# Altium project shkb_pro3_lite.PrjPcb
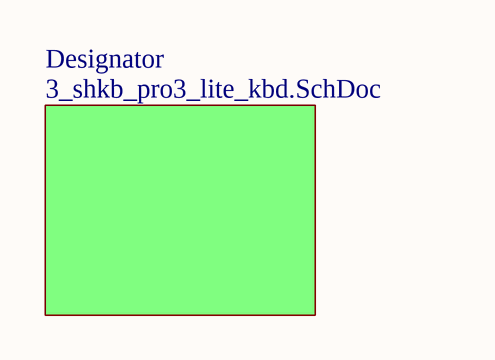
[diagram p0: 1_shkb_pro3_lite_top.SchDoc]
ProjectTitle: SHKB Pro3 Lite; Revision: A1
2 sheets, 37 parts. Net scope: flat (ports and power ports of the same name join across sheets).
Board file: shkb_pro3_lite.PcbDoc
Sheets:
  1_shkb_pro3_lite_top.SchDoc
    Designator = 3_shkb_pro3_lite_kbd.SchDoc

## Sheet 1_shkb_pro3_lite_top.SchDoc: =ProjectTitle
size A4; Address1: github.com/4pplet/SHKB; Address2: Licence: CERN-OHL-S; Revision: A1; SheetNumber: 1; SheetTotal: 3

### Sub-sheets
Designator = 3_shkb_pro3_lite_kbd.SchDoc: no entries

### Notes on the sheet
- Title
- Size:
- Date:
- A4
- Number:
- Time:
- Revision:
- Sheet
- of
- File:

## Sheet 3_shkb_pro3_lite_kbd.SchDoc: =ProjectTitle
size A4; Address1: github.com/4pplet/SHKB; Address2: Licence: CERN-OHL-S; Revision: A1; SheetNumber: 3; SheetTotal: 3
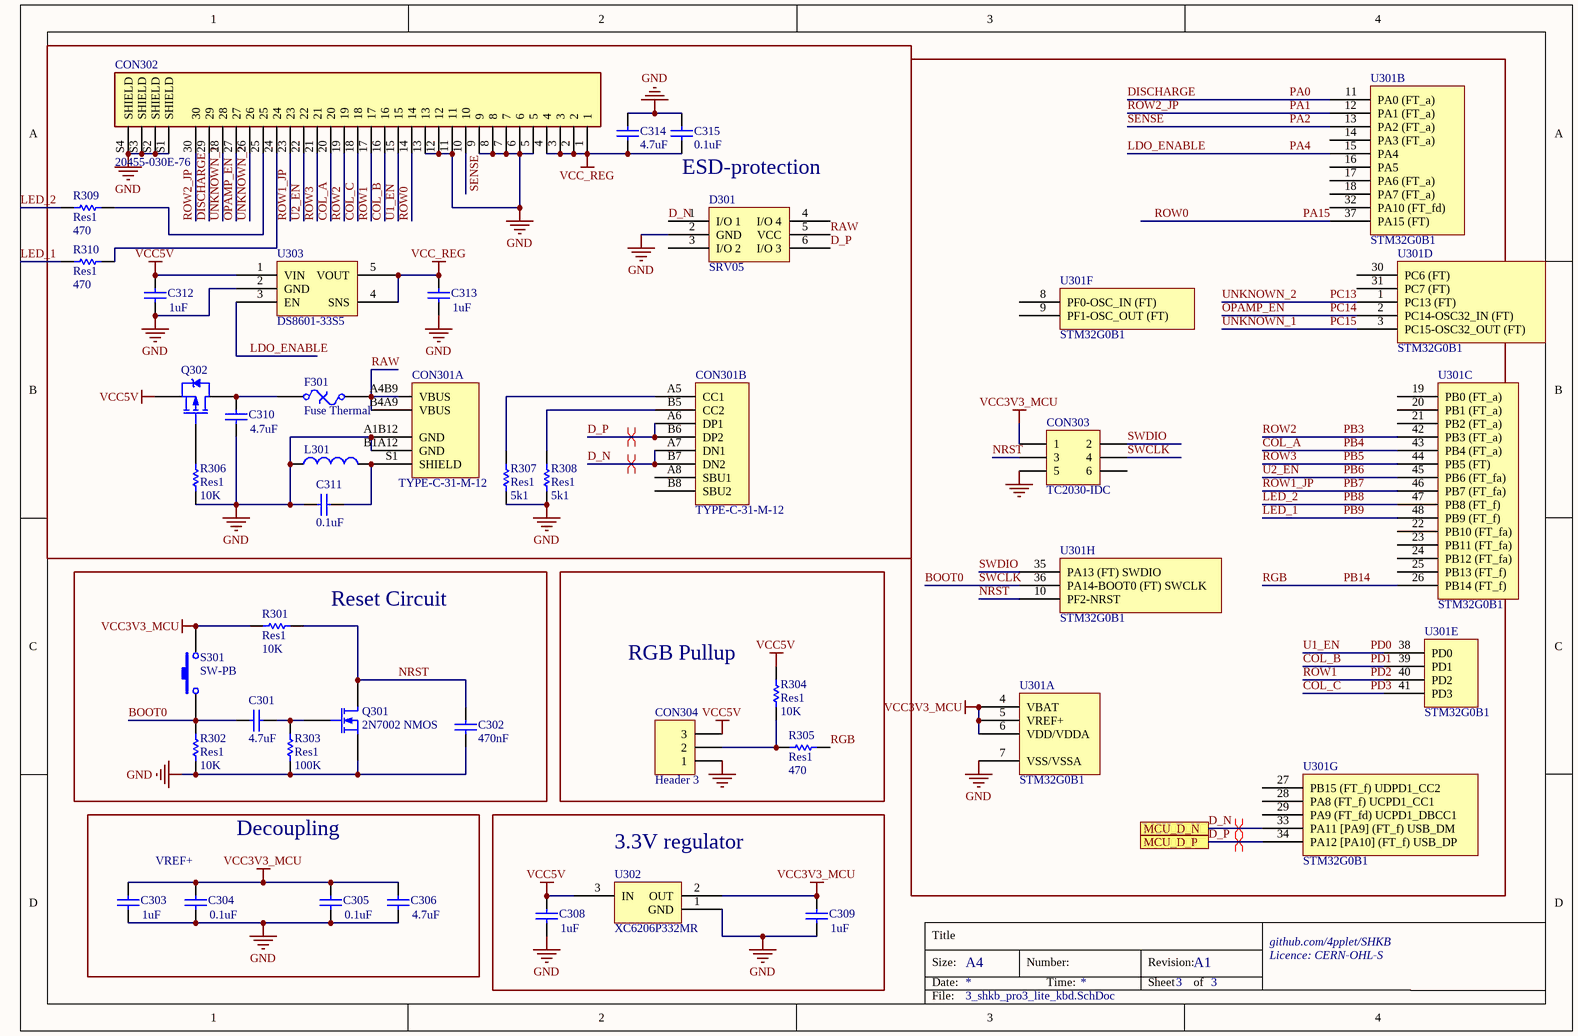
[diagram p1: 3_shkb_pro3_lite_kbd.SchDoc]

### Parts
C301  value 4.7uF  [C0603[1608]]
C302  value 470nF  [C0603[1608]]
C303  value 1uF  [C0603[1608]]
C304  value 0.1uF  [C0603[1608]]
C305  value 0.1uF  [C0603[1608]]
C306  value 4.7uF  [C0603[1608]]
C308  value 1uF  [C0603[1608]]
C309  value 1uF  [C0603[1608]]
C310  value 4.7uF  [C0603[1608]]
C311  value 0.1uF  [C0603[1608]]
C312  value 1uF  [C0603[1608]]
C313  value 1uF  [C0603[1608]]
C314  value 4.7uF  [C0603[1608]]
C315  value 0.1uF  [C0603[1608]]
CON301  TYPE-C-31-M-12  [TYPE-C-31-M-12]  (parts A,B of 2)
CON302  20455-030E-76  [IPEX_20455-030E-76]
CON303  TC2030-IDC  [TC2030-IDC-NL]  (no BOM)
CON304  Header 3  [HDR1X3]
D301  SRV05  [SOT-23-6]
F301  Fuse Thermal  [C1206[3216]]
L301  Inductor  [L0805]  (value not drawn)
Q301  2N7002 NMOS  [SOT-23-3]
Q302  PMOS-2  [SOT-23-3]  (value not drawn)
R301  Res1  value 10K  [R0603[1608]]
R302  Res1  value 10K  [R0603[1608]]
R303  Res1  value 100K  [R0603[1608]]
R304  Res1  value 10K  [R0603[1608]]
R305  Res1  value 470  [R0603[1608]]
R306  Res1  value 10K  [R0603[1608]]
R307  Res1  value 5k1  [R0603[1608]]
R308  Res1  value 5k1  [R0603[1608]]
R309  Res1  value 470  [R0603[1608]]
R310  Res1  value 470  [R0603[1608]]
S301  SW-PB  [TC-1101V-B-A-W]
U301  STM32G0B1  [STM32 - LQFP48, 7x7mm]  (parts A,B,C,D,E,F,G,H of 8)
U302  XC6206P332MR  [SOT-23-3]
U303  DS8601-33S5  [SOT-23-5]

### Blocks framed on the sheet
ESD-protection: C310-C315 CON301 CON302 D301 F301 L301 Q302 R306-R310 U303
Reset Circuit: C301 C302 Q301 R301-R303 S301
RGB Pullup: CON304 R304 R305
Decoupling: C303-C306
3.3V regulator: C308 C309 U302

### Ports
MCU_D_N, MCU_D_P

### Nets
GND: C302.2 C303.1 C304.1 C305.1 C306.1 C308.1 C309.1 C310.1 C311.1 C312.1 C313.1 C314.2 C315.1 CON301.A1B12(GND) CON301.B1A12(GND) CON302.5 CON302.6 CON302.7 CON302.8 CON302.9 CON302.11 CON302.12 CON302.13 CON302.S1(SHIELD) CON302.S2(SHIELD) CON302.S3(SHIELD) CON302.S4(SHIELD) CON303.5 CON304.1 D301.2(GND) L301.1 Q301.2(S) R302.2 R303.2 R306.2 R307.2 R308.2 S301.3(GND) U301.7(VSS/VSSA) U302.1(GND) U303.2(GND)
VCC3V3_MCU: C303.2 C304.2 C305.2 C306.2 C309.2 CON303.1 R301.1 S301.2 U301.4(VBAT) U301.5(VREF+) U301.6(VDD/VDDA) U302.2(OUT)
VCC5V: C308.2 C312.2 CON304.3 Q302.2(S) R304.1 U302.3(IN) U303.1(VIN)
VCC_REG: C313.2 C314.1 C315.2 CON302.1 CON302.2 CON302.3 CON302.4 U303.4(SNS) U303.5(VOUT)
BOOT0: C301.1 CON303.4 R302.1 S301.1 U301.36(PA14-BOOT0_(FT)_SWCLK)  [also labelled SWCLK]
COL_A: CON302.20 U301.43(PB4_(FT_a))  [also labelled PB4]
COL_B: CON302.16 U301.39(PD1)  [also labelled PD1]
COL_C: CON302.18 U301.41(PD3)  [also labelled PD3]
D_N: CON301.A7(DN1) CON301.B7(DN2) D301.1(I/O_1) U301.33(PA11_[PA9]_(FT_f)_USB_DM) ; port MCU_D_N
D_P: CON301.A6(DP1) CON301.B6(DP2) D301.6(I/O_3) U301.34(PA12_[PA10]_(FT_f)_USB_DP) ; port MCU_D_P
DISCHARGE: CON302.29 U301.11(PA0_(FT_a))  [also labelled PA0]
LDO_ENABLE: U301.15(PA4) U303.3(EN)  [also labelled PA4]
LED_1: R310.2 U301.48(PB9_(FT_f))  [also labelled PB9]
LED_2: R309.2 U301.47(PB8_(FT_f))  [also labelled PB8]
NRST: C302.1 CON303.3 Q301.3(D) R301.2 U301.10(PF2-NRST)
OPAMP_EN: CON302.27 U301.2(PC14-OSC32_IN_(FT))  [also labelled PC14]
PA1: CON302.30 U301.12(PA1_(FT_a))  [also labelled ROW2_JP]
PA2: CON302.10 U301.13(PA2_(FT_a))  [also labelled SENSE]
PA15: CON302.14 U301.37(PA15_(FT))  [also labelled ROW0]
PB3: CON302.19 U301.42(PB3_(FT_a))  [also labelled ROW2]
PB5: CON302.21 U301.44(PB5_(FT))  [also labelled ROW3]
PB6: CON302.22 U301.45(PB6_(FT_fa))  [also labelled U2_EN]
PB7: CON302.23 U301.46(PB7_(FT_fa))  [also labelled ROW1_JP]
PB14: R305.2 U301.26(PB14_(FT_f))  [also labelled RGB]
PC13: CON302.26 U301.1(PC13_(FT))  [also labelled UNKNOWN_2]
PC15: CON302.28 U301.3(PC15-OSC32_OUT_(FT))  [also labelled UNKNOWN_1]
PD0: CON302.15 U301.38(PD0)  [also labelled U1_EN]
PD2: CON302.17 U301.40(PD2)  [also labelled ROW1]
RAW: CON301.A4B9(VBUS) CON301.B4A9(VBUS) D301.5(VCC) F301.2
SWDIO: CON303.2 U301.35(PA13_(FT)_SWDIO)
NetC301_2: C301.2 Q301.1(G) R303.1
NetC310_2: C310.2 F301.1 Q302.3(D)
NetC311_2: C311.2 CON301.S1(SHIELD) L301.2
NetCON301_A5: CON301.A5(CC1) R307.1
NetCON301_B5: CON301.B5(CC2) R308.1
NetCON302_24: CON302.24 R310.1
NetCON302_25: CON302.25 R309.1
NetCON304_2: CON304.2 R304.2 R305.1
NetQ302_1: Q302.1(G) R306.1

Not connected (* = marked no-connect by the designer): CON301 A8(SBU1) B8(SBU2); CON303 6; D301 3(I/O_2) 4(I/O_4); U301 8(PF0-OSC_IN_(FT)) 9(PF1-OSC_OUT_(FT)) 14(PA3_(FT_a)) 16(PA5) 17(PA6_(FT_a)) 18(PA7_(FT_a)) 19(PB0_(FT_a)) 20(PB1_(FT_a)) 21(PB2_(FT_a)) 22(PB10_(FT_fa)) 23(PB11_(FT_fa)) 24(PB12_(FT_fa)) 25(PB13_(FT_f)) 27(PB15_(FT_f)_UDPD1_CC2) 28(PA8_(FT_f)_UCPD1_CC1) 29(PA9_(FT_fd)_UCPD1_DBCC1) 30(PC6_(FT)) 31(PC7_(FT)) 32(PA10_(FT_fd))

### Layout directives
differential pair: D_N, D_P

### Notes on the sheet
- VREF+
- Title
- Size:
- Date:
- A4
- Number:
- Time:
- Revision:
- Sheet
- of
- File:

### Library data of the parts
C301 C306 C310 C314 = Cap: Capacitor; MRF.Part: CL10A475KO8NNNC; LCSC MFG: Samsung Electro-Mechanics; Version: 0603 imperial; LCSC Part #: C19666
C302 = Cap: Capacitor; MRF.Part: CL10B474KA8NNNC; LCSC MFG: Samsung Electro-Mechanics; Version: 0603 imperial; LCSC Part #: C1623
C303 C308 C309 C312 C313 = Cap: Capacitor; MRF.Part: CL10A105KB8NNNC; LCSC MFG: Samsung Electro-Mechanics; Version: 0603 imperial; LCSC Part #: C15849
C304 C305 C311 C315 = Cap: Capacitor; MRF.Part: CC0603KRX7R9BB104; LCSC MFG: YAGEO; Version: 0603 imperial; LCSC Part #: C14663
CON301 = TYPE-C-31-M-12: LCSC MFG: Korean Hroparts Elec; LCSC Part #: C165948; MRF.Part: TYPE-C-31-M-12
CON302 = 20455-030E-76: Micro Coaxial Connector 0.5mm Pitch; LCSC MFG: I-PEX; LCSC Part #: C2890994; MRF.Part: 20455-030E-76
CON303 = Header 3X2: Header, 3-Pin, Dual row; Version: DNP
CON304 = Header 3: Header, 3-Pin; Version: DNP
D301 = SRV05: MRF.Part: SRV05-4-P-T7; LCSC MFG: ProTek Devices; LCSC Part #: C85364
F301 = Fuse Thermal: Thermal Fuse; MRF.Part: ASMD1206-050; LCSC MFG: Shenzhen JDT Fuse; LCSC Part #: C135338
L301 = Inductor: MRF.Part: GZ2012D101TF; LCSC MFG: Sunlord; LCSC Part #: C1015; Version: 0806 imperial
Q301 = MOSFET-N: N-Channel MOSFET; LCSC MFG: Changjiang Electronics Tech (CJ); LCSC Part #: C8545; MRF.Part: 2N7002
Q302 = PMOS-2: P-Channel Power MOSFET; MRF.Part: SI2301CDS-T1-GE3; LCSC MFG: Vishay Intertech; LCSC Part #: C10487; Version: SOT23-3
R301 R302 R304 R306 = Res1: Resistor; MRF.Part: 0603WAF1002T5E; LCSC MFG: Uniroyal Elec; Version: 0603 imperial; LCSC Part #: C25804
R303 = Res1: Resistor; MRF.Part: 0603WAF1003T5E; LCSC MFG: Uniroyal Elec; Version: 0603 imperial; LCSC Part #: C25803
R305 R309 R310 = Res1: Resistor; MRF.Part: 0603WAF4700T5E; LCSC MFG: UNI-ROYAL(Uniroyal Elec); Version: 0603 imperial; LCSC Part #: C23179
R307 R308 = Res1: Resistor; MRF.Part: 0603WAF5101T5E; LCSC MFG: Uniroyal Elec; Version: 0603 imperial; LCSC Part #: C23186
S301 = SW-PB: Switch; LCSC MFG: XKB Connection; LCSC Part #: C561498; MRF.Part: TC-1101V-B-A-W
U301 = STM32G0B1: MRF.Part: C2847904; LCSC MFG: STMicroelectronics; LCSC Part #: STM32G0B1CBT6
U302 = SOT23 LDO: LCSC MFG: Torex Semicon; LCSC Part #: C5446; MRF.Part: XC6206P332MR
U303 = DS8601-33S5: LCSC MFG: DSTECH; LCSC Part #: C5795656; MRF.Part: DS8601-33S5